# EAGLE design TTL640x480-DIODE (EAGLE 9.4.2)
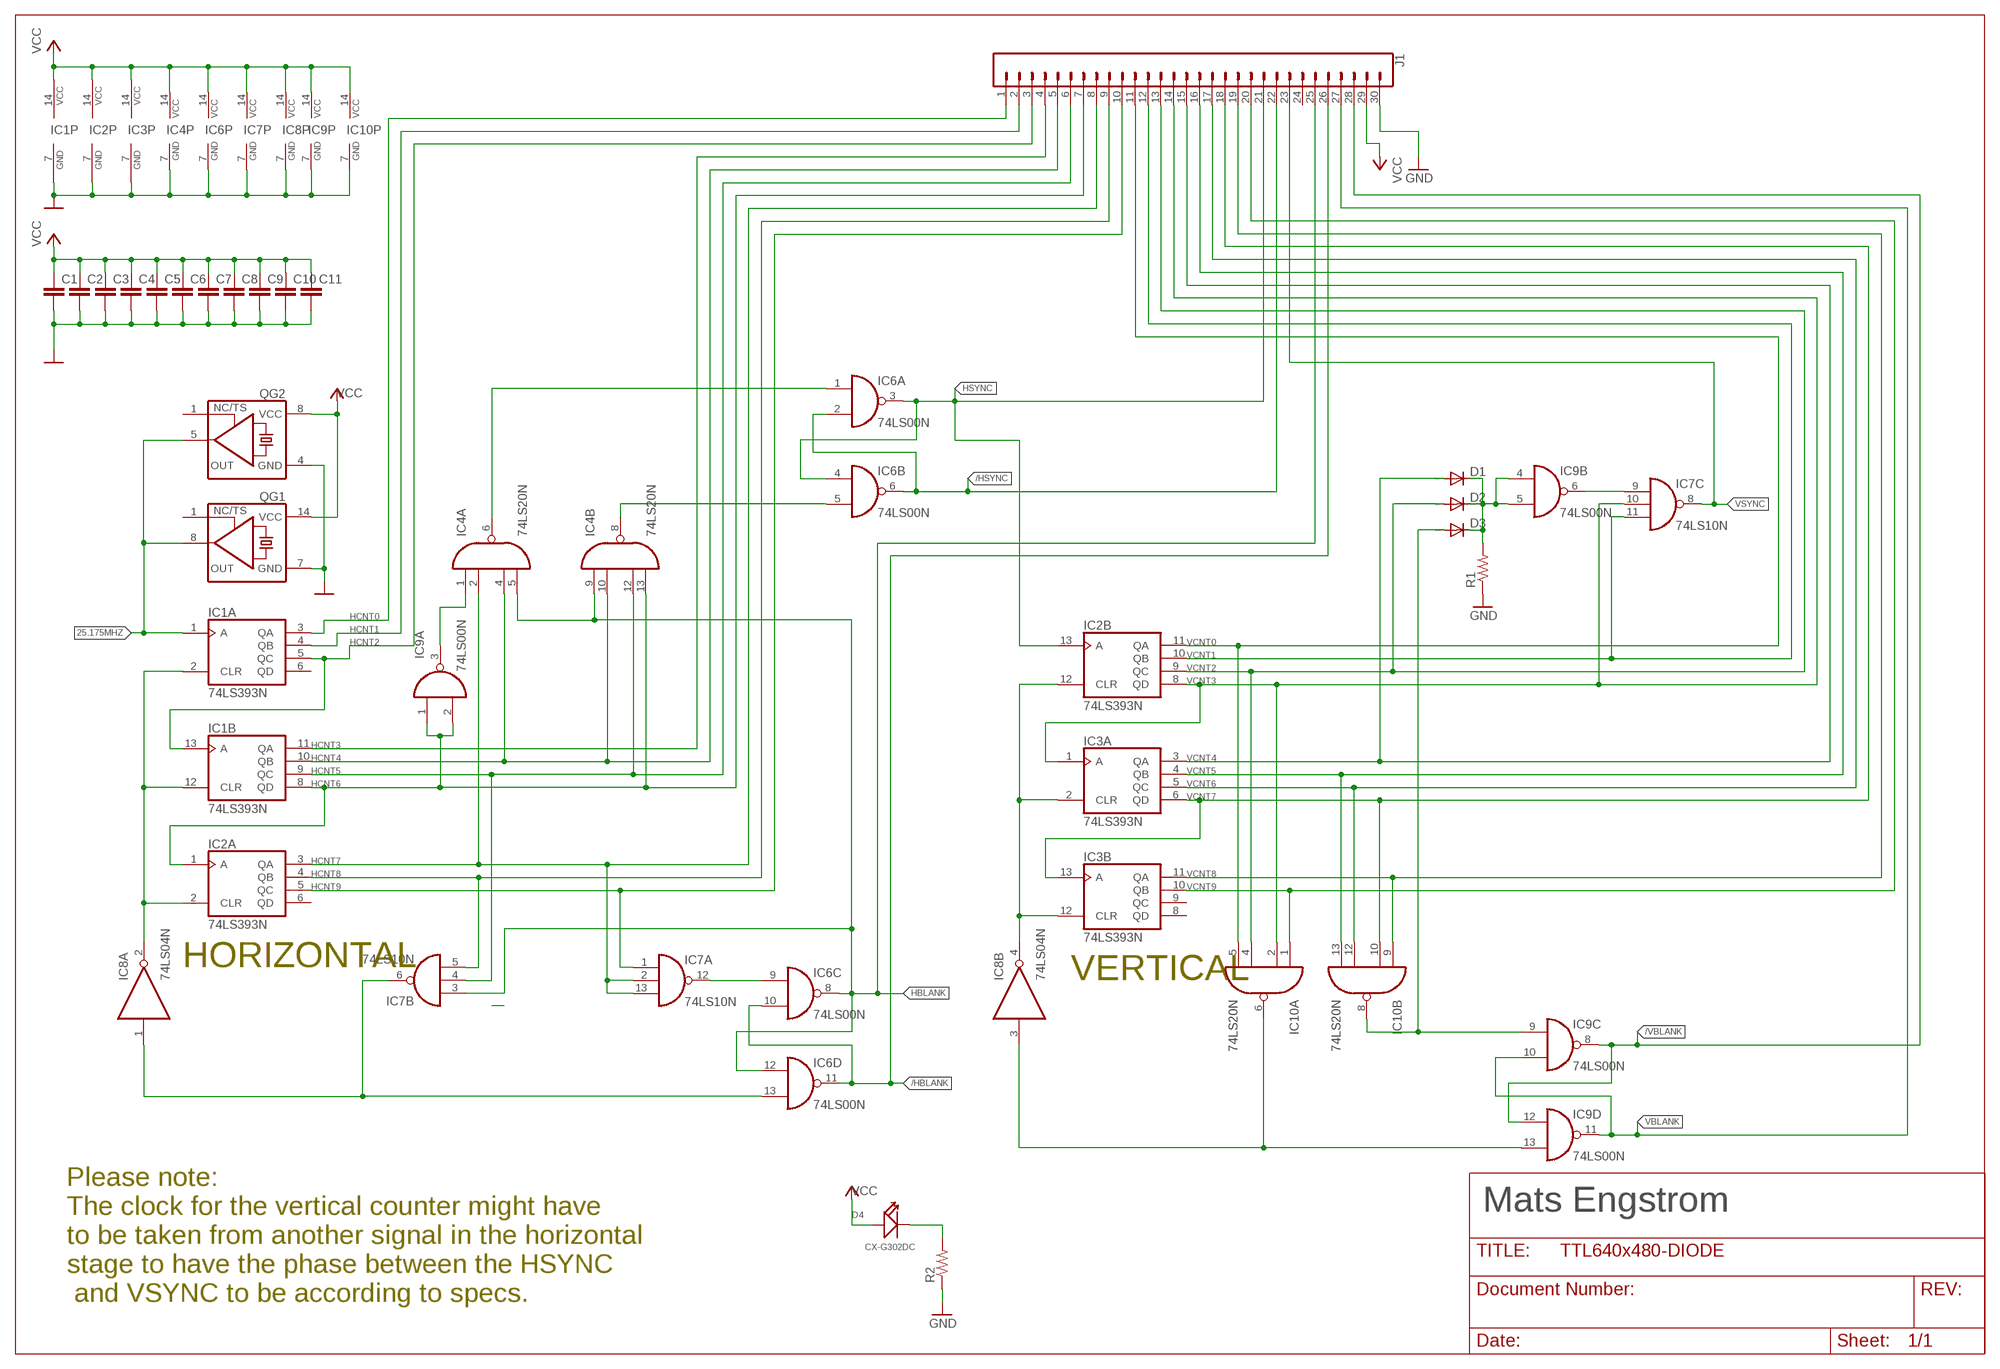
[diagram p0: schematic, sheet 1]

## Parts
C1  C-EU050-024X044  [C050-024X044]
C2  C-EU050-024X044  [C050-024X044]
C3  C-EU050-024X044  [C050-024X044]
C4  C-EU050-024X044  [C050-024X044]
C5  C-EU050-024X044  [C050-024X044]
C6  C-EU050-024X044  [C050-024X044]
C7  C-EU050-024X044  [C050-024X044]
C8  C-EU050-024X044  [C050-024X044]
C9  C-EU050-024X044  [C050-024X044]
C10  C-EU050-024X044  [C050-024X044]
C11  C-EU050-024X044  [C050-024X044]
D1  1N4148DO35-10  [DO35-10]
D2  1N4148DO35-10  [DO35-10]
D3  1N4148DO35-10  [DO35-10]
D4  CX-G302DC  DIP-LED-GREEN-GREEN(2P-D3MM)  [LED2-2.54-D3.0MM]
IC1  74LS393N  [DIL14]
IC2  74LS393N  [DIL14]
IC3  74LS393N  [DIL14]
IC4  74LS20N  [DIL14]
IC6  74LS00N  [DIL14]
IC7  74LS10N  [DIL14]
IC8  74LS04N  [DIL14]
IC9  74LS00N  [DIL14]
IC10  74LS20N  [DIL14]
J1  CONN_30  [1X30]
QG1  XO-14  [DIL14S]
QG2  XO-8  [DIL08S]
R1  R-US_0204/7  [0204/7]
R2  R-US_0204/7  [0204/7]

## Nets
25.175MHZ: IC1.1(A:A) QG1.8(OUT) QG2.5(OUT)
/HBLANK: IC6.10(C:I1) IC6.11(D:O) J1.26
/HSYNC: IC6.2(A:I1) IC6.6(B:O) J1.22
/VBLANK: IC9.8(C:O) IC9.12(D:I0) J1.28
GND: C1.2 C2.2 C3.2 C4.2 C5.2 C6.2 C7.2 C8.2 C9.2 C10.2 C11.2 IC1.7(P:GND) IC2.7(P:GND) IC3.7(P:GND) IC4.7(P:GND) IC6.7(P:GND) IC7.7(P:GND) IC8.7(P:GND) IC9.7(P:GND) IC10.7(P:GND) J1.30 QG1.7(GND) QG2.4(GND) R1.1 R2.1
HBLANK: IC4.5(A:I3) IC4.9(B:I0) IC6.8(C:O) IC6.12(D:I0) IC7.3(B:I0) J1.25
HCNT0: IC1.3(A:QA) J1.1
HCNT1: IC1.4(A:QB) J1.2
HCNT2: IC1.5(A:QC) IC1.13(B:A) J1.3
HCNT3: IC1.11(B:QA) J1.4
HCNT4: IC1.10(B:QB) IC4.4(A:I2) IC4.10(B:I1) J1.5
HCNT5: IC1.9(B:QC) IC4.12(B:I2) IC7.4(B:I1) J1.6
HCNT6: IC1.8(B:QD) IC2.1(A:A) IC4.13(B:I3) IC9.1(A:I0) IC9.2(A:I1) J1.7
HCNT7: IC2.3(A:QA) IC4.2(A:I1) IC7.2(A:I1) IC7.13(A:I2) J1.8
HCNT8: IC2.4(A:QB) IC7.5(B:I2) J1.9
HCNT9: IC2.5(A:QC) IC7.1(A:I0) J1.10
HSYNC: IC2.13(B:A) IC6.3(A:O) IC6.4(B:I0) J1.21
N$1: D1.C D2.C D3.C IC9.4(B:I0) IC9.5(B:I1) R1.2
N$2: IC4.1(A:I0) IC9.3(A:O)
N$3: IC1.2(A:CLR) IC1.12(B:CLR) IC2.2(A:CLR) IC8.2(A:O)
N$4: D3.A IC9.9(C:I0) IC10.8(B:O)
N$5: IC7.9(C:I0) IC9.6(B:O)
N$6: IC2.12(B:CLR) IC3.2(A:CLR) IC3.12(B:CLR) IC8.4(B:O)
N$8: IC8.3(B:I) IC9.13(D:I1) IC10.6(A:O)
N$9: D4.K(-) R2.2
N$10: IC4.6(A:O) IC6.1(A:I0)
N$11: IC4.8(B:O) IC6.5(B:I1)
N$12: IC6.9(C:I0) IC7.12(A:O)
N$13: IC6.13(D:I1) IC7.6(B:O) IC8.1(A:I)
VBLANK: IC9.10(C:I1) IC9.11(D:O) J1.27
VCC: C1.1 C2.1 C3.1 C4.1 C5.1 C6.1 C7.1 C8.1 C9.1 C10.1 C11.1 D4.A(+) IC1.14(P:VCC) IC2.14(P:VCC) IC3.14(P:VCC) IC4.14(P:VCC) IC6.14(P:VCC) IC7.14(P:VCC) IC8.14(P:VCC) IC9.14(P:VCC) IC10.14(P:VCC) J1.29 QG1.14(VCC) QG2.8(VCC)
VCNT0: IC2.11(B:QA) IC10.5(A:I3) J1.11
VCNT1: IC2.10(B:QB) IC7.11(C:I2) J1.12
VCNT2: D2.A IC2.9(B:QC) IC10.4(A:I2) J1.13
VCNT3: IC2.8(B:QD) IC3.1(A:A) IC7.10(C:I1) IC10.2(A:I1) J1.14
VCNT4: D1.A IC3.3(A:QA) J1.15
VCNT5: IC3.4(A:QB) IC10.13(B:I3) J1.16
VCNT6: IC3.5(A:QC) IC10.12(B:I2) J1.17
VCNT7: IC3.6(A:QD) IC3.13(B:A) IC10.10(B:I1) J1.18
VCNT8: IC3.11(B:QA) IC10.9(B:I0) J1.19
VCNT9: IC3.10(B:QB) IC10.1(A:I0) J1.20
VSYNC: IC7.8(C:O) J1.23
Unconnected: IC1.6(A:QD) IC2.6(A:QD) IC3.8(B:QD) IC3.9(B:QC) IC8.5(C:I) IC8.6(C:O) IC8.8(D:O) IC8.9(D:I) IC8.10(E:O) IC8.11(E:I) IC8.12(F:O) IC8.13(F:I) J1.24 QG1.1(TS) QG2.1(TS)

## Notes on the sheet
- HORIZONTAL
- VERTICAL
- Mats Engstrom
- Please note: 
  The clock for the vertical counter might have 
  to be taken from another signal in the horizontal 
  stage to have the phase between the HSYNC
   and VSYNC to be according to specs.

## Library data of the parts
C1-C11 = rcl:C-EU: CAPACITOR, European symbol; SPICEPREFIX: C
D1-D3 = diode:1N4148: DIODE high speed (Philips)
D4 = Seeed-LED:DIP-LED-GREEN-GREEN(2P-D3MM): 304090040; MPN: CX-G302DC
IC1-IC3 = 74xx-us:74*393: Dual 4-bit decade and binary COUNTER
IC4 IC10 = 74xx-eu:74*20: Dual 4-input NAND gate
IC6 IC9 = 74xx-eu:74*00: Quad 2-input NAND gate
IC7 = 74xx-eu:74*10: Triple 3-input NAND gate
IC8 = 74xx-eu:74*04: Hex INVERTER
J1 = SparkFun-Connectors:CONN_30: Multi connection point. Often used as Generic Header-pin footprint for 0.1 inch spaced/style header connections On any of the 0.1 inch spaced packages, you can populate with these: Break Away Headers - Straight <https://www.sparkfun.com/products/116> (PRT-00116) Break Away Male Headers - Right Angle <https://www.sparkfun.com/products/553> (PRT-00553) Female Headers <https://www.sparkfun.com/products/115> (PRT-00115) Break Away Headers - Machine Pin <https://www.sparkfun.com/products/117> (PRT-00117) Break Away Female Headers - Swiss Machine Pin <https://www.sparkfun.com/products/743> (PRT-00743) For SCREWTERMINALS and SPRING TERMINALS visit here: Screw Terimnals on SparkFun.com <https://www.sparkfun.com/search/results?term=Screw+Terminals> (5mm/3.5mm/2.54mm spacing) This device is also useful as a general connection point to wire up your design to another part of your project. Our various solder wires solder well into these plated through hole pads. Hook-Up Wire - Assortment (Stranded, 22 AWG) <https://www.sparkfun.com/products/11375> (PRT-11375) Hook-Up Wire - Assortment (Solid Core, 22 AWG) <https://www.sparkfun.com/products/11367> (PRT-11367) View the entire wire category on our website here <https://www.sparkfun.com/categories/141> Special notes: Molex polarized connector foot print use with SKU : PRT-08231 with associated crimp pins and housings. 1MM SMD Version SKU: PRT-10208 NOTES ON THE VARIANTS LOCK and LOCK_LONGPADS... This footprint was designed to help hold the alignment of a through-hole component (i.e. 6-pin header) while soldering it into place. You may notice that each hole has been shifted either up or down by 0.005 of an inch from it's more standard position (which is a perfectly straight line). This slight alteration caused the pins (the squares in the middle) to touch the edges of the holes. Because they are alternating, it causes a "brace" to hold the component in place. 0.005 has proven to be the perfect amount of "off-center" position when using our standard breakaway headers. Although looks a little odd when you look at the bare footprint, once you have a header in there, the alteration is very hard to notice. Also,if you push a header all the way into place, it is covered up entirely on the bottom side.
QG1 QG2 = crystal:XO-: CRYSTAL; OC_FARNELL: unknown; OC_NEWARK: unknown
R1 R2 = resistor:R-US_: RESISTOR, American symbol

## Board
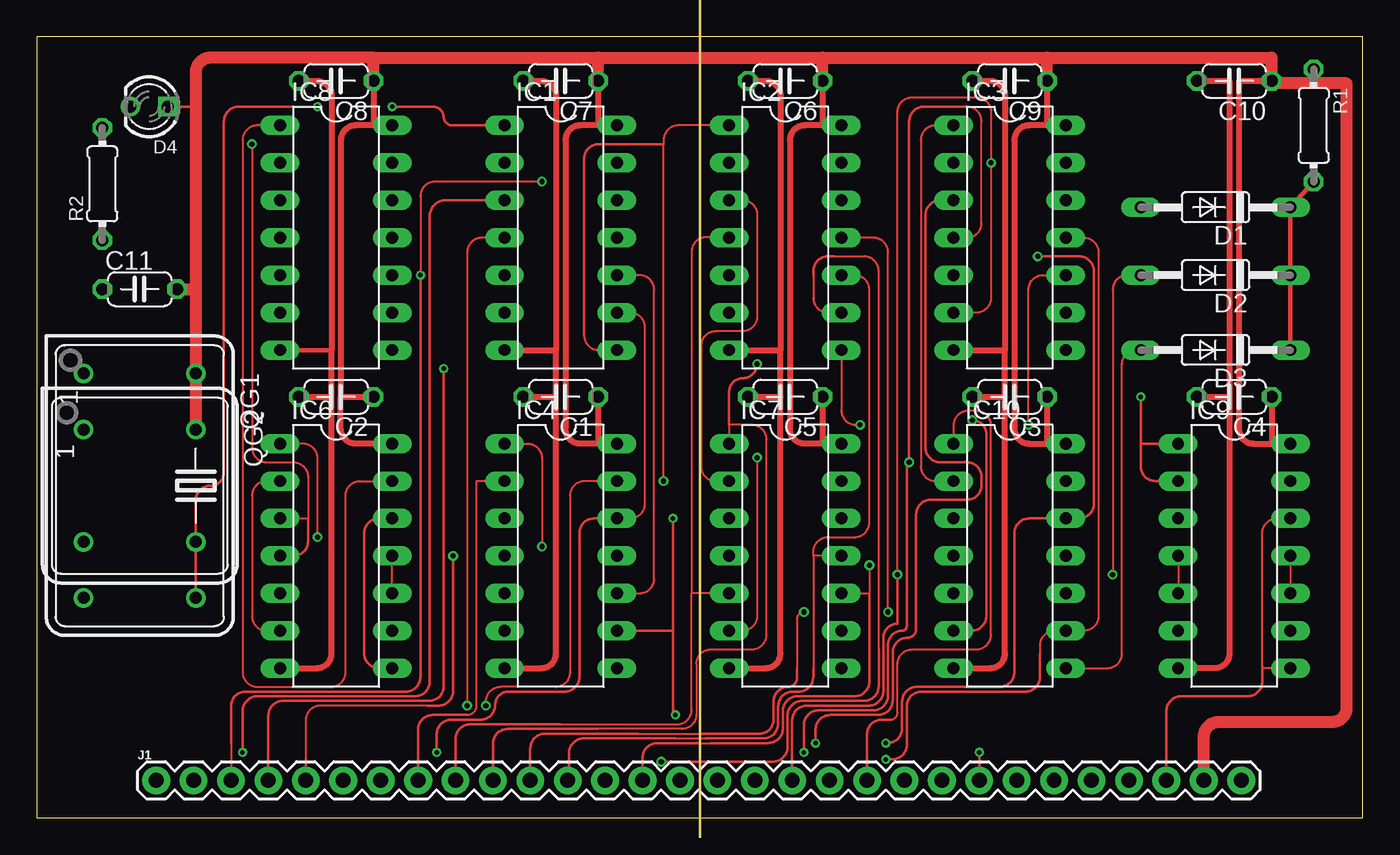
[diagram p1: board, top side]
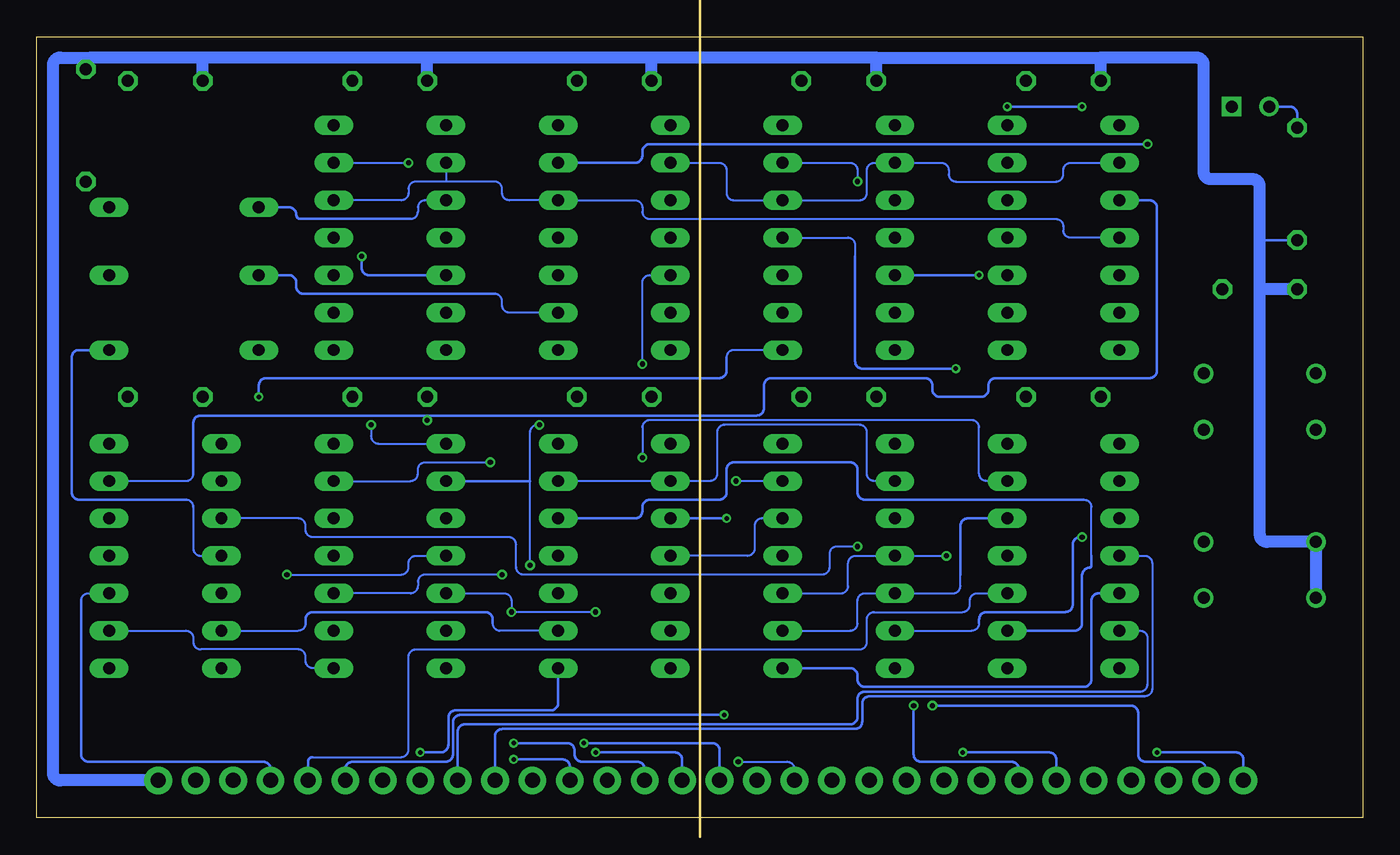
[diagram p2: board, bottom side, seen from below]

Size 90 x 53 mm. Coordinates in mm from the lower left corner, seen from the top.
Outline: 0,0 90,0 90,53 0,53 0,0
Copper layers (1*16): Top 0.035mm / dielectric 1.5mm / Bottom 0.035mm
Design rules "dirt_cheap_dirty_boards.v1.1": minimum track width 6mil, minimum drill 12mil, track to track 6mil, track to pad 6mil, pad to pad 6mil, via to via 6mil, smd to smd 0mil, copper to edge 10mil, drill to drill 10mil, minimum pad ring 10mil, minimum via ring 6mil, stop-mask expansion 2mil, vias tented up to drill 25mil, thermal gap 10mil
Milling: 1 lines

### Footprints (pad centres in the part's own frame; a part is rotated, then mirrored left to right if it is on the bottom)
C050-024X044 = drill 0.813 octagon: 1 -2.54,0; 2 2.54,0
DO35-10 = drill 0.813 long: A 5.08,0; C -5.08,0
LED2-2.54-D3.0MM = drill 0.813 square: A -1.27,0 | drill 0.813: K 1.27,0
DIL14 = drill 0.813 long: 1 -7.62,-3.81; 2 -5.08,-3.81; 3 -2.54,-3.81; 4 0,-3.81; 5 2.54,-3.81; 6 5.08,-3.81; 7 7.62,-3.81; 8 7.62,3.81; 9 5.08,3.81; 10 2.54,3.81; 11 0,3.81; 12 -2.54,3.81; 13 -5.08,3.81; 14 -7.62,3.81
1X30 = drill 1.016 pad 1.88: 1 0,0; 2 2.54,0; 3 5.08,0; 4 7.62,0; 5 10.16,0; 6 12.7,0; 7 15.24,0; 8 17.78,0; 9 20.32,0; 10 22.86,0; 11 25.4,0; 12 27.94,0; 13 30.48,0; 14 33.02,0; 15 35.56,0; 16 38.1,0; 17 40.64,0; 18 43.18,0; 19 45.72,0; 20 48.26,0; 21 50.8,0; 22 53.34,0; 23 55.88,0; 24 58.42,0; 25 60.96,0; 26 63.5,0; 27 66.04,0; 28 68.58,0; 29 71.12,0; 30 73.66,0
DIL14S = drill 0.813: 1 -7.62,-3.81; 7 7.62,-3.81; 8 7.62,3.81; 14 -7.62,3.81
DIL08S = drill 0.813: 1 -3.81,-3.81; 4 3.81,-3.81; 5 3.81,3.81; 8 -3.81,3.81
0204/7 = drill 0.813 octagon: 1 -3.81,0; 2 3.81,0

### Placement (x,y rotation side)
C1  35.56,28.57 180 top
C2  20.32,28.57 180 top
C3  66.04,28.57 180 top
C4  81.28,28.57 180 top
C5  50.8,28.57 180 top
C6  50.8,50.01 180 top
C7  35.56,50.01 180 top
C8  20.32,50.01 180 top
C9  66.04,50.01 180 top
C10  81.28,50.01 180 top
C11  6.99,35.88 180 top
D1  80.01,41.43 180 top
D2  80.01,36.83 180 top
D3  80.01,31.75 180 top
D4  7.62,48.26 180 top
IC1  35.56,39.37 270 top
IC2  50.8,39.37 270 top
IC3  66.04,39.37 270 top
IC4  35.56,17.78 270 top
IC6  20.32,17.78 270 top
IC7  50.8,17.78 270 top
IC8  20.32,39.37 270 top
IC9  81.28,17.78 270 top
IC10  66.04,17.78 270 top
J1  8.1,2.54 0 top
QG1  6.99,22.54 270 top
QG2  6.99,22.54 270 top
R1  86.68,46.99 270 top
R2  4.45,43.02 90 top

### Tracks (layer width: path | path; a pad name or v marks a point on that pad's centre or on a via)
25.175MHZ  (via drill 0.3)
  Top 0.159: v19.05,48.26 13.81,48.26 13.7,48.26 arc90 12.7,47.26 12.7,23.45 arc-90 11.79,22.54 arc90 10.79,21.54 QG2.5 QG1.8 | IC1.1 28.3,46.99 arc-90 27.62,47.51 arc90 26.88,48.26 v24.13,48.26
  Bottom 0.159: v19.05,48.26 v24.13,48.26
/HBLANK
  Top 0.152: IC6.10 IC6.11
  Bottom 0.152: 71.28,4.13 65.27,4.13 arc-90 64.77,4.63 64.77,10.93 arc90 64.27,11.43 34.16,11.43 arc-90 33.66,11.93 33.66,13.47 arc90 33.16,13.97 27.17,13.97 arc-90 26.67,14.47 26.67,14.74 arc90 26.17,15.24 IC6.10
  Bottom 0.159: J1.26 71.6,3.81 arc90 71.28,4.13
/HSYNC
  Top 0.152: IC6.6 15.61,12.7 arc-90 14.61,13.7 14.61,21.86 arc-90 15.61,22.86 IC6.2
  Bottom 0.152: IC6.6 15.11,12.7 arc90 14.61,12.2 14.61,9.07 arc90 15.11,8.57
  Bottom 0.159: J1.22 61.44,5.85 arc90 60.94,6.35 34.79,6.35 arc-90 34.29,6.85 34.29,8.07 arc90 33.79,8.57 15.11,8.57
/VBLANK
  Top 0.152: 83.82,10.16 IC9.8 83.19,10.16 83.19,10.32 83.19,19.32 arc-90 84.19,20.32 IC9.12
  Top 0.159: J1.28 76.68,7.25 arc-90 77.68,8.26 82.19,8.26 arc90 83.19,9.26 83.19,10.32
GND
  Top 0.305: IC8.7 20,31.75
  Top 0.406: IC6.7 19,10.16 arc90 20,11.16 20,28.57 | 20,28.57 20,31.75 20,49.01 arc90 19,50.01 C8.2 | IC4.7 34.24,10.16 arc90 35.24,11.16 35.24,28.57 | 35.24,28.57 35.24,31.75 | C7.2 34.24,50.01 arc-90 35.24,49.01 35.24,31.75 | IC7.7 49.48,10.16 arc90 50.48,11.16 50.48,28.57 | 50.48,28.57 50.48,31.75 | IC10.7 64.72,10.16 arc90 65.72,11.16 65.72,28.57 | 65.72,28.57 65.72,31.75 | IC1.7 35.24,31.75 | IC2.7 50.48,31.75 | IC3.7 65.72,31.75 | 80.96,28.57 80.96,11.16 arc-90 79.96,10.16 IC9.7 | 80.96,28.57 80.96,50.01 C10.2 | 65.72,31.75 65.72,49.01 arc90 64.72,50.01 C9.2 | C6.2 49.48,50.01 arc-90 50.48,49.01 50.48,31.75 | C2.2 20,28.57 | C1.2 35.24,28.57 | C5.2 50.48,28.57 | C3.2 65.72,28.57 | C4.2 80.96,28.57
  Bottom 0.159: 86.36,51.59 86.36,51.44 R1.1 | R2.1 6.99,39.21
  Bottom 0.813: C8.2 17.78,51.59 | 33.02,51.59 17.78,51.59 | 33.02,51.59 48.26,51.59 | 48.26,51.59 63.5,51.59 | 63.5,51.59 78.74,51.59 | 78.74,51.59 86.36,51.59 88.4,51.59 arc-90 88.9,51.09 88.9,3.04 arc-90 88.4,2.54 J1.30 | C9.2 63.5,51.59 | C6.2 48.26,51.59 | C7.2 33.02,51.59 | C10.2 78.74,51.59 | QG1.7 QG2.4 6.49,18.73 arc90 6.99,19.23 6.99,35.88 | C11.2 6.99,35.88 | 6.99,35.88 6.99,39.21 6.99,42.84 arc-90 7.49,43.34 10.29,43.34 arc90 10.79,43.84 10.79,51.09 arc-90 11.29,51.59 17.78,51.59
HBLANK  (via drill 0.3)
  Top 0.159: IC6.12 23.23,20.32 arc90 22.23,19.32 22.23,11.16 arc90 23.23,10.16 IC6.8 | v43.18,20.32 43.18,12.7 | 43.18,12.7 43.18,6.99 v43.34,6.99 | IC4.9 43.18,12.7
  Bottom 0.152: 27.3,16.51 27.3,15.74 arc90 27.8,15.24 IC4.5 33.79,15.24 arc-90 34.29,14.74 34.29,13.2 arc90 34.79,12.7 IC4.9
  Bottom 0.159: IC6.12 26.8,20.32 arc-90 27.3,19.82 27.3,16.51 | v43.18,20.32 IC7.3 | v43.34,6.99 61.25,6.99 arc-90 61.75,6.49 61.75,4.31 arc90 62.25,3.81 68.56,3.81 arc-90 69.06,3.31 J1.25
HCNT0  (via drill 0.3)
  Top 0.159: IC1.3 27.67,41.91 arc90 26.67,40.75 26.67,9.26 arc-90 25.67,8.26 14.97,8.26 arc90 13.97,7.25 v13.97,4.45
  Bottom 0.159: J1.1 8.1,3.94 arc-90 8.6,4.45 v13.97,4.45
HCNT1  (via drill 0.35)
  Top 0.152: IC1.4 30.21,39.37 arc90 29.21,38.37 v29.21,7.62
  Bottom 0.152: 11.14,3.81 arc90 10.64,3.31 J1.2
  Bottom 0.159: v29.21,7.62 15.74,7.62 arc90 15.24,7.12 15.24,4.31 arc-90 14.74,3.81 11.14,3.81
HCNT2  (via drill 0.3, 0.35)
  Top 0.152: v34.29,43.18 27.04,43.18 arc90 26.04,42.18 v26.04,36.83 | 13.18,5.08 J1.3
  Top 0.159: 13.18,5.08 13.18,7.57 arc-90 14.18,8.57 25.04,8.57 arc90 26.04,9.57 v26.04,36.83
  Bottom 0.152: IC1.13 34.79,44.45 arc90 34.29,43.95 v34.29,43.18
  Bottom 0.159: IC1.5 v26.04,36.83
HCNT3  (via drill 0.3)
  Top 0.159: v27.62,30.48 27.62,8.94 arc-90 26.62,7.94 16.72,7.94 arc90 15.72,6.94 J1.4
  Bottom 0.152: IC1.11 34.95,39.37 arc90 34.45,38.87 34.45,38.1
  Bottom 0.159: 34.45,38.1 34.45,30.98 arc-90 33.95,30.48 v27.62,30.48
HCNT4  (via drill 0.35)
  Top 0.152: IC1.10 40.91,36.83 arc-90 41.91,35.83 41.91,16.24 arc-90 40.91,15.24 IC4.10 | 26.83,7.62 26.51,7.62 19.26,7.62 arc90 18.26,6.62 J1.5
  Top 0.159: v28.26,17.78 28.26,8.62 arc-90 27.26,7.62 26.51,7.62
  Bottom 0.152: v28.26,17.78 IC4.4 34.42,17.78 arc-90 34.92,17.28 34.92,15.74 arc90 35.42,15.24 IC4.10
HCNT5  (via drill 0.3)
  Top 0.152: IC1.9 40.27,34.29 arc-90 41.27,33.29 41.27,21.32 arc-90 40.27,20.32 IC4.12
  Top 0.159: v27.15,4.45 27.15,5.67 arc-90 28.15,6.67 30.11,6.67 arc90 31.11,7.67 arc-90 32.02,8.57 35.83,8.57 arc90 36.83,9.57 36.83,19.32 arc-90 37.83,20.32 IC4.12
  Bottom 0.152: IC7.4 41.77,17.78 arc-90 41.27,18.28 41.27,19.82 arc90 40.77,20.32 IC4.12
  Bottom 0.159: v27.15,4.45 21.3,4.45 arc90 20.8,3.94 J1.6
HCNT6  (via drill 0.3, 0.35)
  Top 0.152: v30.48,7.62 30.48,7.89 arc-90 31.48,8.89 35.2,8.89 arc90 36.2,9.89 36.2,21.86 arc-90 37.2,22.86 IC4.13 | IC2.1 43.55,46.99 arc90 42.55,45.99 42.55,45.72 v42.55,22.86 | 37.15,32.75 arc90 38.15,31.75 IC1.8
  Top 0.159: 42.55,45.76 42.55,45.72 38.15,45.72 arc90 37.15,44.72 37.15,32.75 | IC9.2 75.93,22.86 arc-90 74.93,23.86 74.93,25.4 | 74.93,25.4 v74.93,28.57 | IC9.1 74.93,25.4
  Bottom 0.152: IC1.8 42.68,31.75 arc-90 43.18,31.25 | IC4.13 v42.55,22.86
  Bottom 0.159: v30.48,7.62 30.48,4.31 arc-90 29.98,3.81 23.84,3.81 arc90 23.34,3.31 J1.7 | 43.18,31.25 43.18,30.34 arc90 43.68,29.84 74.43,29.84 arc-90 74.93,29.34 v74.93,28.57
HCNT7
  Top 0.152: IC7.2 46.09,22.86 arc-90 45.09,23.86 45.09,32.02 arc-90 46.09,33.02 47.9,33.02 arc90 48.9,34.02 48.9,40.93 arc89 47.91,41.93 46.99,41.95 arc-180 IC2.3 | IC4.2 29.84,22.86 29.84,7.62 arc-90 29.21,6.99
  Top 0.159: J1.8 25.88,5.99 arc-90 26.88,6.99 29.21,6.99
  Bottom 0.152: IC7.13 IC7.2 44.31,22.86 arc-90 43.81,23.36 43.81,26.17 arc90 43.31,26.67 34.16,26.67 arc90 33.66,26.17 33.66,23.36 arc-90 33.16,22.86 IC4.2
HCNT8
  Top 0.152: 35.56,6.35 43.45,6.35 arc90 44.45,7.35 44.45,15.24 | IC7.5 44.45,15.24 | IC2.4 46.99,39.41 45.45,39.41 arc90 44.45,38.41 44.45,15.24
  Top 0.159: J1.9 28.42,5.35 arc-90 29.42,6.35 35.56,6.35
HCNT9  (via drill 0.35)
  Top 0.152: 38.1,6.03 43.77,6.03 arc90 44.77,7.03 44.77,10.43 arc-90 45.77,11.43 48.53,11.43 arc90 49.53,12.43 49.53,25.67 arc90 48.53,26.67 46.99,26.67 IC7.1
  Top 0.159: v48.9,30.8 arc-90 47.94,29.84 arc90 46.99,28.89 46.99,26.67 | J1.10 30.96,5.03 arc-90 31.96,6.03 38.1,6.03
  Bottom 0.152: v48.9,30.8 48.9,36.33 arc90 48.4,36.83 IC2.5
HSYNC  (via drill 0.35)
  Top 0.152: IC6.3 18.41,20.32 18.41,23.13 arc90 17.41,24.13 15.61,24.13 arc-90 14.61,25.13 v14.61,45.72
  Top 0.159: IC6.4 17.41,17.78 arc90 18.41,18.78 18.41,20.32
  Bottom 0.152: IC6.4 14.79,17.78 arc90 14.29,17.28 14.29,8.76 arc90 14.79,8.26
  Bottom 0.159: v14.61,45.72 48.4,45.72 arc-90 48.9,45.22 48.9,44.95 arc90 49.4,44.45 IC2.13 | J1.21 58.9,5.53 arc90 58.4,6.03 34.47,6.03 arc-90 33.97,6.53 33.97,7.75 arc90 33.47,8.26 14.79,8.26
N$1
  Top 0.152: IC9.4 IC9.5
  Top 0.305: R1.2 D1.C D2.C D3.C
  Bottom 0.152: 79.88,21.59 arc90 79.38,21.09 79.38,18.28 arc-90 78.88,17.78 IC9.4
  Bottom 0.159: D3.C 87.13,31.75 arc-90 87.63,31.25 87.63,22.09 arc-90 87.13,21.59 79.88,21.59
N$2  (via drill 0.35)
  Top 0.152: IC4.1 33.29,25.4 arc-90 34.29,24.4 v34.29,18.41
  Bottom 0.152: IC9.3 72.25,20.32 arc90 71.75,19.82 71.75,19.55 arc-90 71.25,19.05 57.97,19.05 arc90 57.47,18.55 57.47,17.01 arc-90 56.97,16.51 36.7,16.51 arc-90 36.2,17.01 36.2,17.91 arc90 35.7,18.41 v34.29,18.41
N$3
  Bottom 0.152: IC2.2 43.68,44.45 arc90 43.18,43.95 43.18,42.41 arc-90 42.68,41.91 IC1.12 34.16,41.91 arc-90 33.66,42.41 33.66,43.95 arc90 33.16,44.45 IC1.2 28.6,44.45 arc90 28.1,43.95 28.1,43.68 arc-90 27.6,43.18 20.82,43.18 arc-90 20.32,43.68 20.32,43.95 arc90 19.82,44.45 IC8.2
N$4
  Top 0.152: D3.A 74.66,31.75 arc90 73.66,30.75 73.66,11.16 arc-90 72.66,10.16 IC10.8
  Bottom 0.152: IC10.8 71.25,10.16 arc90 71.75,10.66 71.75,10.93 arc-90 72.25,11.43 78.88,11.43 arc90 79.38,11.93 79.38,12.2 arc-90 79.88,12.7 IC9.9
N$5
  Bottom 0.152: IC7.9 58.55,12.7 arc90 59.05,13.2 | IC9.6 72.25,12.7 arc-90 71.75,13.2
  Bottom 0.159: 71.75,13.2 71.75,13.47 arc90 71.25,13.97 59.55,13.97 arc90 59.05,13.47 59.05,13.2
N$6
  Bottom 0.152: 62.23,43.18 58.92,43.18 arc90 58.42,42.68 58.42,42.41 arc-90 57.92,41.91 IC2.12 49.4,41.91 arc90 48.9,41.41 48.9,41.14 arc-90 48.4,40.64 20.82,40.64 arc90 20.32,40.14 20.32,39.87 arc-90 19.82,39.37 IC8.4 | 62.23,43.18 64.27,43.18 arc-90 64.77,42.68 64.77,42.41 arc90 65.27,41.91 IC3.12 | IC3.2 62.23,43.18
N$8  (via drill 0.35)
  Top 0.159: IC10.6 63.45,12.7 arc90 64.45,13.7 64.45,26.04 arc90 v63.5,26.99
  Bottom 0.152: 79.38,23.36 arc90 79.88,22.86 IC9.13
  Bottom 0.159: 63.5,27.3 41.14,27.3 arc-90 40.64,27.8 40.64,29.34 arc90 40.14,29.84 29.71,29.84 arc90 29.21,29.34 29.21,29.07 arc-90 28.71,28.57 25.9,28.57 arc-90 25.4,29.07 25.4,29.34 arc90 24.9,29.84 14.47,29.84 arc-90 13.97,30.34 13.97,41.41 arc-90 14.47,41.91 IC8.3 | v63.5,26.99 63.5,27.3 | 79.38,23.36 79.38,26.8 arc90 78.88,27.3 63.5,27.3
N$9
  Bottom 0.159: D4.K 4.95,48.26 arc90 4.45,47.76 R2.2
N$10  (via drill 0.35)
  Top 0.152: v19.05,19.05 19.05,24.4 arc90 18.05,25.4 IC6.1
  Bottom 0.152: IC4.6 26.54,12.7 arc-90 26.04,13.2
  Bottom 0.159: v19.05,19.05 19.18,19.05 arc-90 19.68,18.55 19.68,14.47 arc90 20.18,13.97 25.54,13.97 arc-90 26.04,13.47 26.04,13.2
N$11
  Bottom 0.159: IC6.5 17.91,15.24 arc-90 18.41,14.74 18.41,9.39 arc90 18.91,8.89 33.79,8.89 arc90 34.29,9.39 34.29,9.66 arc-90 34.79,10.16 IC4.8
N$12
  Bottom 0.152: 18.41,17.78 18.41,21.09 arc-90 18.91,21.59
  Bottom 0.159: IC7.12 49.4,20.32 arc-90 48.9,20.82 48.9,21.09 arc90 48.4,21.59 43.68,21.59 arc-90 43.18,22.09 43.18,23.63 arc90 42.68,24.13 34.79,24.13 arc90 34.29,23.63 34.29,22.09 arc-90 33.79,21.59 18.91,21.59 | IC6.9 19.55,12.7 arc-90 19.05,13.2 19.05,16.33 arc90 18.55,16.99 arc-90 18.41,17.12 18.41,17.78
N$13  (via drill 0.35)
  Top 0.152: IC8.1 14.97,46.99 arc90 13.97,45.99 13.97,9.89 arc90 14.97,8.89 19.95,8.89 arc90 20.95,9.89 20.95,21.86 arc-90 21.95,22.86 IC6.13 | v48.9,24.45 48.9,13.7 arc-90 47.9,12.7 IC7.6
  Bottom 0.152: v48.9,24.45 48.9,26.49 arc90 48.4,26.99 26.54,26.99 arc90 26.04,26.49 26.04,23.36 arc-90 25.54,22.86 IC6.13
VBLANK
  Top 0.152: IC9.11 IC9.10
  Bottom 0.152: 87,14.74 arc90 86.5,15.24 IC9.10
  Bottom 0.159: J1.27 74.14,3.31 arc-90 74.64,3.81 86.5,3.81 arc90 87,4.31 87,14.74
VCC
  Top 0.159: 10.79,48.26 D4.A
  Top 0.406: IC10.14 68.58,25.4 | 68.58,25.4 67.36,25.4 arc-90 66.36,26.4 66.36,45.99 arc-90 67.36,46.99 68.58,46.99 | IC7.14 53.18,25.4 | 53.18,25.4 52.12,25.4 arc-90 51.12,26.4 51.12,45.99 arc-90 52.12,46.99 53.34,46.99 | IC2.14 53.34,46.99 | IC3.14 68.58,46.99 | IC4.14 38.1,25.4 | 38.1,25.4 36.88,25.4 arc-90 35.88,26.4 35.88,45.99 arc-90 36.88,46.99 38.1,46.99 | IC6.14 21.64,25.4 arc-90 20.64,26.4 20.64,28.57 | 22.86,46.99 21.64,46.99 arc90 20.64,45.99 20.64,28.57 | IC8.14 22.86,46.99 | IC1.14 38.1,46.99 | IC9.14 83.82,25.4 | 83.82,25.4 82.6,25.4 arc-90 81.6,26.4 81.6,50.01 C10.1 | 20.64,28.57 C2.1 | C3.1 68.58,25.4 | C9.1 68.58,46.99 | C6.1 53.34,46.99 | C7.1 38.1,46.99 | C1.1 38.1,25.4 | C5.1 53.34,25.56 53.18,25.4 | C4.1 83.82,25.4 | C8.1 22.86,46.99
  Top 0.813: C8.1 22.86,51.59 | 22.86,51.59 38.1,51.59 | 38.1,51.59 53.34,51.59 | 53.34,51.59 68.58,51.59 | 68.58,51.59 83.82,51.59 C10.1 83.82,49.85 88.92,49.85 88.92,7.51 arc-90 87.92,6.51 80.22,6.51 arc90 79.22,5.51 J1.29 | C9.1 68.58,51.59 | C6.1 53.34,51.59 | C7.1 38.1,51.59 | QG2.8 QG1.14 10.79,35.88 | 22.86,51.59 11.79,51.59 arc90 10.79,50.59 10.79,48.26 10.79,35.88 | C11.1 10.79,35.88
VCNT0  (via drill 0.35)
  Top 0.152: v52.07,13.97 arc90 51.59,13.49 51.59,10.16 | v57.78,13.97 57.78,38.37 arc90 56.78,39.37 IC2.11 | 33.59,2.57 J1.11 | 40.8,5.71 45.09,5.71
  Top 0.159: 40.8,5.71 34.5,5.71 arc90 33.5,4.71 33.5,2.57 33.59,2.57 | 45.09,5.71 49.05,5.71 arc90 50.01,6.67 50.01,7.89 arc-90 51.01,8.89 arc90 51.59,9.48 51.59,10.16
  Bottom 0.152: v52.07,13.97 v57.78,13.97 57.78,14.74 arc-90 58.28,15.24 IC10.5
VCNT1
  Top 0.152: IC7.11 52.7,17.78 | 36.13,2.57 J1.12 | 43.34,5.4 45.4,5.4 | 52.7,17.78 52.7,10.16 | IC2.10 55.52,36.83 arc-90 56.52,35.83 56.52,20.05 arc-90 55.52,19.05 53.7,19.05 arc90 52.7,18.05 52.7,17.78
  Top 0.159: 43.34,5.4 37.13,5.4 arc90 36.13,4.4 36.13,2.57 | 45.4,5.4 49.32,5.4 arc90 50.32,6.4 50.32,7.57 arc-90 51.32,8.57 51.7,8.57 arc90 52.7,9.57 52.7,10.16
VCNT2  (via drill 0.35)
  Top 0.152: D2.A 74.03,36.83 arc90 73.03,35.83 v73.03,16.51 | 54.13,38.1 56.15,38.1 arc-90 57.15,37.1 57.15,11.43 | 52.7,36.83 52.7,35.29 arc90 53.7,34.29 IC2.9
  Top 0.159: v42.39,3.81 49.96,3.81 arc90 50.96,4.81 50.96,6.94 arc-90 51.96,7.94 56.15,7.94 arc90 57.15,8.94 57.15,11.43 | 52.7,36.83 52.7,37.1 arc-90 53.7,38.1 54.13,38.1
  Bottom 0.152: v73.03,16.51 65.27,16.51 arc-90 64.77,17.01 64.77,17.28 arc90 64.27,17.78 IC10.4 | v42.39,3.81 39.08,3.81 arc90 38.58,3.31 J1.13 | IC2.9 57.92,34.29 arc90 58.42,34.79 58.42,35.06 arc-90 58.92,35.56
  Bottom 0.159: D2.A 72.89,36.83 arc90 72.39,36.33 72.39,36.06 arc-90 71.89,35.56 58.92,35.56
VCNT3  (via drill 0.35)
  Top 0.152: IC3.1 61.01,46.99 arc90 60.01,45.99 60.01,23.86 arc90 61.01,22.86 IC10.2 | 44.93,5.08 45.72,5.08 | IC7.10 56.52,15.24 v56.52,17.14 | IC2.8 54.61,27.67 arc90 55.61,26.67 v55.88,26.67
  Top 0.159: 45.72,5.08 49.64,5.08 arc90 50.64,6.08 50.64,7.25 arc-90 51.64,8.26 55.52,8.26 arc90 56.52,9.26 56.52,15.24 | 44.93,5.08 42.12,5.08 arc90 41.12,4.08 J1.14
  Bottom 0.152: v56.52,17.14 56.52,22.86 56.52,26.17 arc90 56.02,26.67 v55.88,26.67
  Bottom 0.159: IC10.2 56.52,22.86
VCNT4  (via drill 0.3)
  Top 0.159: IC3.3 61.33,41.91 arc90 60.33,40.91 60.33,25.13 arc90 61.33,24.13 63.13,24.13 arc-90 64.14,23.13 64.14,22.59 arc-90 63.13,21.59 60.69,21.59 arc90 59.69,20.59 59.69,12.81 arc-90 59.1,12.22 arc90 58.1,11.22 58.1,7.99 arc-90 57.1,6.99 53.86,6.99 arc90 52.86,5.99 v52.86,5.08
  Bottom 0.152: 64.64,40.64 arc-90 64.14,41.14 64.14,41.41 arc90 63.63,41.91 IC3.3
  Bottom 0.159: J1.15 43.66,4.58 arc-90 44.16,5.08 v52.86,5.08 | D1.A 72.89,41.43 arc90 72.39,40.93 arc-90 72.1,40.64 64.64,40.64
VCNT5  (via drill 0.3, 0.35)
  Top 0.152: IC3.4 63.13,39.37 arc90 64.14,40.37 64.14,47.26 arc90 63.13,48.26
  Top 0.159: v52.07,4.45 52.07,6.3 arc-90 53.07,7.3 56.78,7.3 arc90 57.78,8.3 57.78,11.75 arc-90 58.74,12.7 arc90 59.05,13.02 59.05,24.13 v59.21,24.13 59.21,47.26 arc-90 60.21,48.26 63.13,48.26
  Bottom 0.152: v59.21,24.13 63.63,24.13 arc-90 64.14,23.63 64.14,23.36 arc90 64.64,22.86 IC10.13
  Bottom 0.159: J1.16 46.2,3.94 arc-90 46.7,4.45 v52.07,4.45
VCNT6  (via drill 0.3, 0.35)
  Top 0.159: v67.94,38.1 70.75,38.1 arc-90 71.75,37.1 71.75,21.32 arc-90 70.75,20.32 IC10.12 67.36,20.32 arc90 66.36,19.32 66.36,9.89 arc-90 65.36,8.89 59.74,8.89 arc90 58.74,7.89 58.74,6.08 arc-90 57.74,5.08 v57.63,5.08
  Bottom 0.159: IC3.5 67.44,36.83 arc90 67.94,37.33 v67.94,38.1 | v57.63,5.08 54,5.08 arc90 53.5,4.58 53.5,4.31 arc-90 53,3.81 49.24,3.81 arc90 48.74,3.31 J1.17
VCNT7  (via drill 0.35)
  Top 0.152: IC3.6 63.77,34.29 arc90 64.77,35.29 v64.77,44.45 64.77,47.9 arc90 63.77,48.9 59.42,48.9 arc90 58.42,47.9 v58.42,16.51
  Top 0.159: J1.18 51.28,6.62 arc-90 52.28,7.62 56.47,7.62 arc90 57.47,8.62 57.47,12.22 arc-90 58.42,13.18 v58.42,16.51
  Bottom 0.152: IC3.13 v64.77,44.45 | IC10.10 64.64,15.24 arc-90 64.14,15.74 64.14,16.01 arc90 63.63,16.51 v58.42,16.51
VCNT8  (via drill 0.3)
  Top 0.152: IC3.11 71.07,39.37 arc-90 72.07,38.37 72.07,13.7 arc-90 71.07,12.7 IC10.9 69.77,12.62 69.77,12.7 69.1,12.7 arc90 68.1,11.7 68.1,11.15
  Top 0.159: v57.63,3.97 58.05,3.97 arc90 59.05,4.97 59.05,7.57 arc-90 60.05,8.57 67.1,8.57 arc90 68.1,9.57 68.1,11.15
  Bottom 0.159: J1.19 53.82,3.47 arc-90 54.32,3.97 v57.63,3.97
VCNT9  (via drill 0.35)
  Top 0.152: IC10.1 62.23,26.62 arc-90 63.23,27.62 63.77,27.62 arc-90 64.77,26.62 64.77,12.43 arc-90 63.77,11.43 59.42,11.43 arc90 58.42,10.43 58.42,7.14 arc-90 57.94,6.67 | v67.31,26.67 67.31,35.83 arc-90 68.31,36.83 IC3.10
  Top 0.159: 57.94,6.67 57.36,6.67 arc90 56.36,5.67 J1.20
  Bottom 0.152: v67.31,26.67 67.31,25.9 arc-90 66.81,25.4 IC10.1
VSYNC  (via drill 0.3)
  Top 0.159: v63.98,4.45 J1.23
  Bottom 0.159: v63.98,4.45 62.57,4.45 arc-90 62.07,4.95 62.06,4.95 62.06,6.8 arc90 61.56,7.3 55.11,7.3 arc-90 54.61,7.8 IC7.8